# EAGLE schematic CAN Tester rev2 (EAGLE 9.2.2)
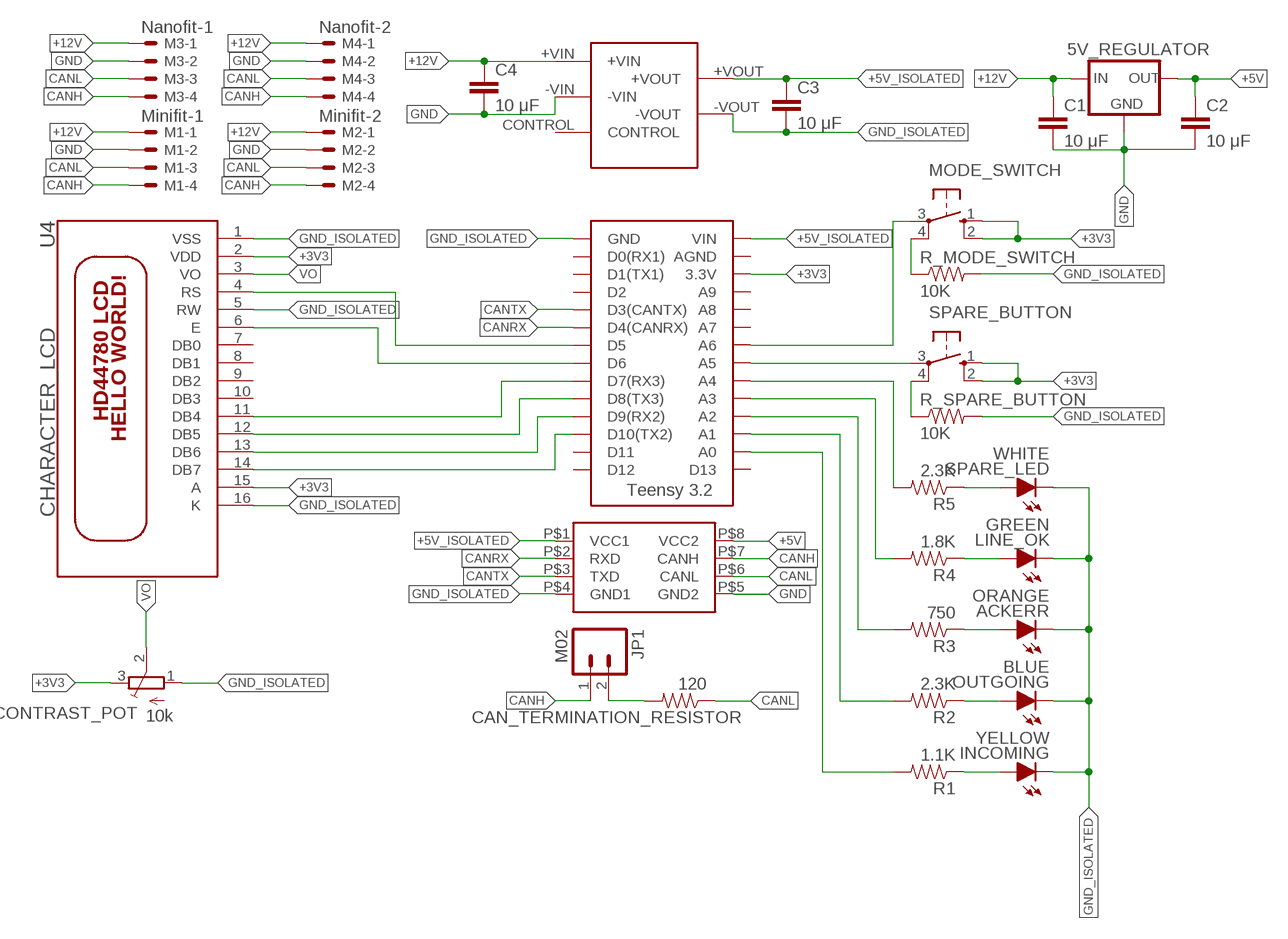
[diagram p0: schematic, sheet 1]

## Parts
5V_REGULATOR  5VREG_LM340-NLM340MPX-5.0/NOPB  [SOT223]
ACKERR  ORANGE  LED-0805  [LED-805]
C1  10 μF  CAP0805  [0805]
C2  10 μF  CAP0805  [0805]
C3  10 μF  CAP0805  [0805]
C4  10 μF  CAP0805  [0805]
CAN_TERMINATION_RESISTOR  120  RESISTOR0805-RES  [0805]
CONTRAST_POT  10k  TRIMPOT3386  [TRIM-3386]
INCOMING  YELLOW  LED-0805  [LED-805]
JP1  M02  [1X02]
LINE_OK  GREEN  LED-0805  [LED-805]
M1  Minifit-1  CONNECTOR-4  [MINIFIT_5566-4]
M2  Minifit-2  CONNECTOR-4  [MINIFIT_5566-4]
M3  Nanofit-1  CONNECTOR-4NANO-FIT-VERTICAL-4  [NANO-FIT_VERTICAL-4]
M4  Nanofit-2  CONNECTOR-4NANO-FIT-VERTICAL-4  [NANO-FIT_VERTICAL-4]
MODE_SWITCH  BTN_10-XX  [B3F-10XX]
OUTGOING  BLUE  LED-0805  [LED-805]
R1  1.1K  RESISTOR0805-RES  [0805]
R2  2.3K  RESISTOR0805-RES  [0805]
R3  750  RESISTOR0805-RES  [0805]
R4  1.8K  RESISTOR0805-RES  [0805]
R5  2.3K  RESISTOR0805-RES  [0805]
R_MODE_SWITCH  10K  RESISTOR0805-RES  [0805]
R_SPARE_BUTTON  10K  RESISTOR0805-RES  [0805]
SPARE_BUTTON  BTN_10-XX  [B3F-10XX]
SPARE_LED  WHITE  LED-0805  [LED-805]
U1  ISOCAN  ISO1050CAN  [DUB8]
U3  TEENSY_3.2_SIMPLE  [TEENSY_3.2_SIMPLE]
U4  CHARACTER_LCD  HD44780LCD-1602  [LCD1602]
U$1  NCS1S1205SC-12V-5VCONVERTER  [DCDC-CONVERTER]

## Nets
+3V3: CONTRAST_POT.3(E) MODE_SWITCH.1(S) MODE_SWITCH.2(S1) SPARE_BUTTON.1(S) SPARE_BUTTON.2(S1) U3.3.3V U4.2(VDD) U4.15(A)
+5V: 5V_REGULATOR.3(OUT) C2.1 U1.P$8(VCC2)
+5V_ISOLATED: C3.1 U1.P$1(VCC1) U3.VIN U$1.+VOUT
+12V: 5V_REGULATOR.1(IN) C1.1 C4.1 M1.1 M2.1 M3.P$1 M4.P$1 U$1.+VIN
CANH: JP1.1 M1.4 M2.4 M3.P$4 M4.P$4 U1.P$7(CANH)
CANL: CAN_TERMINATION_RESISTOR.1 M1.3 M2.3 M3.P$3 M4.P$3 U1.P$6(CANL)
CANRX: U1.P$2(RXD) U3.D4(CANRX)
CANTX: U1.P$3(TXD) U3.D3(CANTX)
GND: 5V_REGULATOR.2(GND) 5V_REGULATOR.4(GND) C1.2 C2.2 C4.2 M1.2 M2.2 M3.P$2 M4.P$2 U1.P$5(GND2) U$1.-VIN
GND_ISOLATED: ACKERR.C C3.2 CONTRAST_POT.1(A) INCOMING.C LINE_OK.C OUTGOING.C R_MODE_SWITCH.2 R_SPARE_BUTTON.2 SPARE_LED.C U1.P$4(GND1) U3.GND U4.1(VSS) U4.5(RW) U4.16(K) U$1.-VOUT
N$1: R1.2 U3.A0
N$2: R5.1 SPARE_LED.A
N$3: SPARE_BUTTON.3(P) U3.A5
N$4: R2.2 U3.A1
N$5: R3.2 U3.A2
N$6: R4.2 U3.A3
N$7: R5.2 U3.A4
N$8: LINE_OK.A R4.1
N$9: ACKERR.A R3.1
N$10: OUTGOING.A R2.1
N$11: INCOMING.A R1.1
N$12: MODE_SWITCH.4(P1) R_MODE_SWITCH.1
N$13: MODE_SWITCH.3(P) U3.A6
N$14: R_SPARE_BUTTON.1 SPARE_BUTTON.4(P1)
N$15: CAN_TERMINATION_RESISTOR.2 JP1.2
N$17: U3.D5 U4.4(RS)
N$18: U3.D6 U4.6(E)
N$19: U3.D7(RX3) U4.11(DB4)
N$20: U3.D8(TX3) U4.12(DB5)
N$21: U3.D9(RX2) U4.13(DB6)
N$22: U3.D10(TX2) U4.14(DB7)
VO: CONTRAST_POT.2(S) U4.3(VO)
Unconnected: U3.A7 U3.A8 U3.A9 U3.AGND U3.D0(RX1) U3.D1(TX1) U3.D2 U3.D11 U3.D12 U3.D13 U4.7(DB0) U4.8(DB1) U4.9(DB2) U4.10(DB3) U$1.CONTROL

## Library data of the parts
5V_REGULATOR = HyTechDevices:5VREG_LM340-N: Voltage Regulator 5v linear voltage regulator Datasheet <http://www.mouser.com/ProductDetail/Texas-Instruments/LM340MPX-50-NOPB/?qs=X1J7HmVL2ZGZwtTFRQ9ItA%3D%3D> MAX current out: 1.5A MAX voltage in: 35V
ACKERR INCOMING LINE_OK OUTGOING SPARE_LED = HyTechDevices:LED: Light Emitting Diode (LED) Source: Dangerous Prototypes Eagle Library <https://github.com/DangerousPrototypes/Eagle_Part_Library>
C1-C4 = HyTechDevices:CAP: Capacitor Standard 0603 ceramic capacitor, and 0.1" leaded capacitor.
CAN_TERMINATION_RESISTOR R1-R5 R_MODE_SWITCH R_SPARE_BUTTON = HyTechDevices:RESISTOR: Resistor Basic schematic elements and footprints for 0603, 1206, and PTH resistors.
CONTRAST_POT = HyTechDevices:TRIMPOT: SMT trimmer potentiometer part number TC33X http://www.ladyada.net/library/eagle
JP1 = HyTechDevices:M02: Standard 2-pin 0.1" header. NOTES ON THE VARIANTS LOCK and LOCK_LONGPADS... This footprint was designed to help hold the alignment of a through-hole component (i.e. 6-pin header) while soldering it into place. You may notice that each hole has been shifted either up or down by 0.005 of an inch from it's more standard position (which is a perfectly straight line). This slight alteration caused the pins (the squares in the middle) to touch the edges of the holes. Because they are alternating, it causes a "brace" to hold the component in place. 0.005 has proven to be the perfect amount of "off-center" position when using our standard breakaway headers. Although looks a little odd when you look at the bare footprint, once you have a header in there, the alteration is very hard to notice. Also,if you push a header all the way into place, it is covered up entirely on the bottom side. This idea of altering the position of holes to aid alignment will be further integrated into the Sparkfun Library for other footprints. It can help hold any component with 3 or more connection pins. Note: The Sparkfun version includes many other packages including surface mount that may be of future interest. Source: Sparkfun <https://github.com/sparkfun/SparkFun-Eagle-Libraries>
M1 M2 = HyTechDevices:CONNECTOR-4: Mini-Fit Junior connector 4 pole Source: http://www.molex.com; OC_FARNELL: unknown; OC_NEWARK: unknown
M3 M4 = HyTechDevices:CONNECTOR-4: Mini-Fit Junior connector 4 pole Source: http://www.molex.com
MODE_SWITCH SPARE_BUTTON = HyTechDevices:BTN_10-XX: Small momentary tactile push button; MPN: B3F-1000; OC_FARNELL: 176432; OC_NEWARK: 36M3542
U1 = HyTechDevices:ISO1050CAN
U3 = HyTechDevices:TEENSY_3.2_SIMPLE: Simple version of the Teensy 3.2 board that only uses the 2 main rows of pins, not the inner pins or the pins opposite the usb port.
U4 = HyTechDevices:HD44780LCD: HD44780 LCD Standard character type LCDs, available in sizes from 8x1 to 40x4!
U$1 = HyTechDevices:NCS1S1205SC-12V-5VCONVERTER

## Net classes
0 default: width 0.406 mm, clearance 0.406 mm